# EAGLE design PI3523_EVAL_v2 (EAGLE 9.6.2)
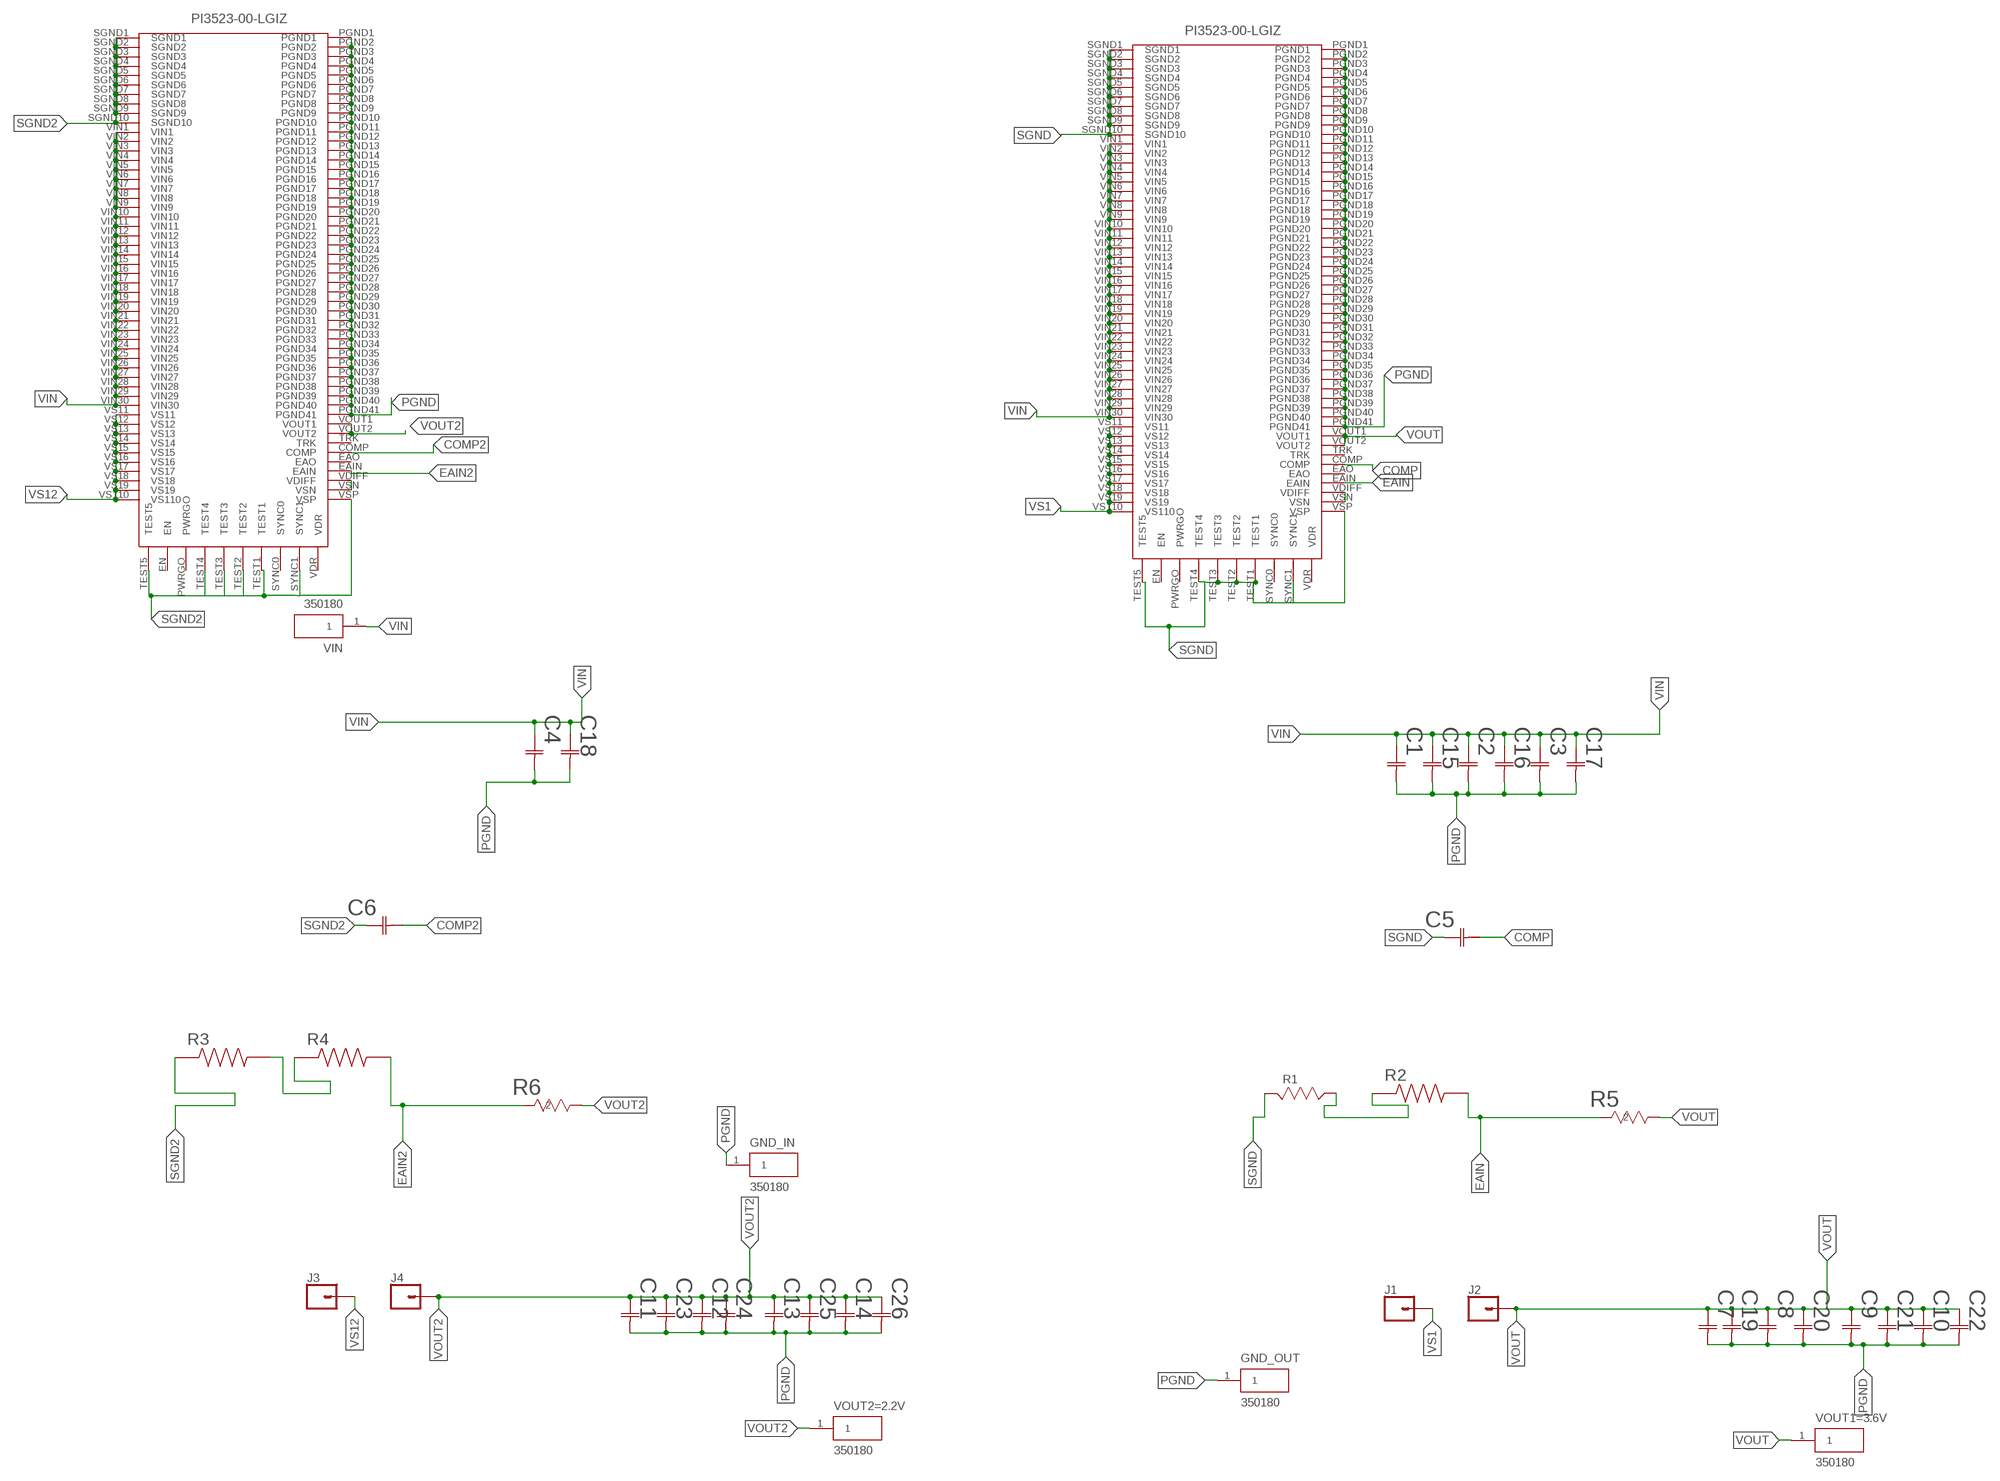
[diagram p0: schematic, sheet 1]

## Parts
C1  GRM32ER72A225KA35L  [G-32_MUR]
C2  GRM32ER72A225KA35L  [G-32_MUR]
C3  GRM32ER72A225KA35L  [G-32_MUR]
C4  GRM32ER72A225KA35L  [G-32_MUR]
C5  C1608C0G2A472J080AC  [CAP_C1608_TDK]
C6  C1608C0G2A472J080AC  [CAP_C1608_TDK]
C7  GRM32EC80J107ME20L  [G-32_MUR]
C8  GRM32EC80J107ME20L  [G-32_MUR]
C9  GRM32EC80J107ME20L  [G-32_MUR]
C10  GRM32EC80J107ME20L  [G-32_MUR]
C11  GRM32EC80J107ME20L  [G-32_MUR]
C12  GRM32EC80J107ME20L  [G-32_MUR]
C13  GRM32EC80J107ME20L  [G-32_MUR]
C14  GRM32EC80J107ME20L  [G-32_MUR]
C15  GRM32ER72A225KA35L  [G-32_MUR]
C16  GRM32ER72A225KA35L  [G-32_MUR]
C17  GRM32ER72A225KA35L  [G-32_MUR]
C18  GRM32ER72A225KA35L  [G-32_MUR]
C19  GRM32EC80J107ME20L  [G-32_MUR]
C20  GRM32EC80J107ME20L  [G-32_MUR]
C21  GRM32EC80J107ME20L  [G-32_MUR]
C22  GRM32EC80J107ME20L  [G-32_MUR]
C23  GRM32EC80J107ME20L  [G-32_MUR]
C24  GRM32EC80J107ME20L  [G-32_MUR]
C25  GRM32EC80J107ME20L  [G-32_MUR]
C26  GRM32EC80J107ME20L  [G-32_MUR]
GND_IN  350180  [TE_350180]
GND_OUT  350180  [TE_350180]
J1  CONN_01  [1X01]
J2  CONN_01  [1X01]
J3  CONN_01  [1X01]
J4  CONN_01  [1X01]
R1  ERJ-3GEY0R00V  [RESC1608X55]
R2  ERA-3APB911V  [RESC1608X55N]
R3  ERJ-3BQJ3R6V  [RESC1608X55N]
R4  ERA-3AEB1961V  [RESC1608X55N]
R5  RT0603BRE072K4L  [RC0603N_YAG]
R6  RT0603BRE072K4L  [RC0603N_YAG]
U$1  PI3523-00-LGIZ  [PI3523-00-LGIZ]
U$2  PI3523-00-LGIZ  [PI3523-00-LGIZ]
VIN  350180  [TE_350180]
VOUT1=3.6V  350180  [TE_350180]
VOUT2=2.2V  350180  [TE_350180]

## Nets
COMP: C5.2 U$2.COMP
COMP2: C6.2 U$1.COMP
EAIN: R2.2 R5.2 U$2.EAIN
EAIN2: R4.2 R6.2 U$1.EAIN
N$3: R3.2 R4.1
N$4: U$2.VDIFF U$2.VSN
N$5: U$1.VDIFF U$1.VSN
PGND [New Class]: C1.2 C2.2 C3.2 C4.2 C7.2 C8.2 C9.2 C10.2 C11.2 C12.2 C13.2 C14.2 C15.2 C16.2 C17.2 C18.2 C19.2 C20.2 C21.2 C22.2 C23.2 C24.2 C25.2 C26.2 GND_IN.1 GND_OUT.1 U$1.PGND1 U$1.PGND2 U$1.PGND3 U$1.PGND4 U$1.PGND5 U$1.PGND6 U$1.PGND7 U$1.PGND8 U$1.PGND9 U$1.PGND10 U$1.PGND11 U$1.PGND12 U$1.PGND13 U$1.PGND14 U$1.PGND15 U$1.PGND16 U$1.PGND17 U$1.PGND18 U$1.PGND19 U$1.PGND20 U$1.PGND21 U$1.PGND22 U$1.PGND23 U$1.PGND24 U$1.PGND25 U$1.PGND26 U$1.PGND27 U$1.PGND28 U$1.PGND29 U$1.PGND30 U$1.PGND31 U$1.PGND32 U$1.PGND33 U$1.PGND34 U$1.PGND35 U$1.PGND36 U$1.PGND37 U$1.PGND38 U$1.PGND39 U$1.PGND40 U$1.PGND41 U$2.PGND1 U$2.PGND2 U$2.PGND3 U$2.PGND4 U$2.PGND5 U$2.PGND6 U$2.PGND7 U$2.PGND8 U$2.PGND9 U$2.PGND10 U$2.PGND11 U$2.PGND12 U$2.PGND13 U$2.PGND14 U$2.PGND15 U$2.PGND16 U$2.PGND17 U$2.PGND18 U$2.PGND19 U$2.PGND20 U$2.PGND21 U$2.PGND22 U$2.PGND23 U$2.PGND24 U$2.PGND25 U$2.PGND26 U$2.PGND27 U$2.PGND28 U$2.PGND29 U$2.PGND30 U$2.PGND31 U$2.PGND32 U$2.PGND33 U$2.PGND34 U$2.PGND35 U$2.PGND36 U$2.PGND37 U$2.PGND38 U$2.PGND39 U$2.PGND40 U$2.PGND41
R21_1: R1.2 R2.1
SGND: C5.1 R1.1 U$2.SGND1 U$2.SGND2 U$2.SGND3 U$2.SGND4 U$2.SGND5 U$2.SGND6 U$2.SGND7 U$2.SGND8 U$2.SGND9 U$2.SGND10 U$2.SYNC1 U$2.TEST1 U$2.TEST2 U$2.TEST3 U$2.TEST4 U$2.TEST5 U$2.VSP
SGND2: C6.1 R3.1 U$1.SGND1 U$1.SGND2 U$1.SGND3 U$1.SGND4 U$1.SGND5 U$1.SGND6 U$1.SGND7 U$1.SGND8 U$1.SGND9 U$1.SGND10 U$1.SYNC1 U$1.TEST1 U$1.TEST2 U$1.TEST3 U$1.TEST4 U$1.TEST5 U$1.VSP
VIN: C1.1 C2.1 C3.1 C4.1 C15.1 C16.1 C17.1 C18.1 U$1.VIN1 U$1.VIN2 U$1.VIN3 U$1.VIN4 U$1.VIN5 U$1.VIN6 U$1.VIN7 U$1.VIN8 U$1.VIN9 U$1.VIN10 U$1.VIN11 U$1.VIN12 U$1.VIN13 U$1.VIN14 U$1.VIN15 U$1.VIN16 U$1.VIN17 U$1.VIN18 U$1.VIN19 U$1.VIN20 U$1.VIN21 U$1.VIN22 U$1.VIN23 U$1.VIN24 U$1.VIN25 U$1.VIN26 U$1.VIN27 U$1.VIN28 U$1.VIN29 U$1.VIN30 U$2.VIN1 U$2.VIN2 U$2.VIN3 U$2.VIN4 U$2.VIN5 U$2.VIN6 U$2.VIN7 U$2.VIN8 U$2.VIN9 U$2.VIN10 U$2.VIN11 U$2.VIN12 U$2.VIN13 U$2.VIN14 U$2.VIN15 U$2.VIN16 U$2.VIN17 U$2.VIN18 U$2.VIN19 U$2.VIN20 U$2.VIN21 U$2.VIN22 U$2.VIN23 U$2.VIN24 U$2.VIN25 U$2.VIN26 U$2.VIN27 U$2.VIN28 U$2.VIN29 U$2.VIN30 VIN.1
VOUT: C7.1 C8.1 C9.1 C10.1 C19.1 C20.1 C21.1 C22.1 J2.1 R5.1 U$2.VOUT1 U$2.VOUT2 VOUT1=3.6V.1
VOUT2: C11.1 C12.1 C13.1 C14.1 C23.1 C24.1 C25.1 C26.1 J4.1 R6.1 U$1.VOUT1 U$1.VOUT2 VOUT2=2.2V.1
VS1: J1.1 U$2.VS11 U$2.VS12 U$2.VS13 U$2.VS14 U$2.VS15 U$2.VS16 U$2.VS17 U$2.VS18 U$2.VS19 U$2.VS110
VS12: J3.1 U$1.VS11 U$1.VS12 U$1.VS13 U$1.VS14 U$1.VS15 U$1.VS16 U$1.VS17 U$1.VS18 U$1.VS19 U$1.VS110
Unconnected: U$1.EAO U$1.EN U$1.PWRGO U$1.SYNC0 U$1.TRK U$1.VDR U$2.EAO U$2.EN U$2.PWRGO U$2.SYNC0 U$2.TRK U$2.VDR

## Library data of the parts
C1-C4 C15-C18 = PI3523_1_1_ul_GRM32ER72A225KA35L:GRM32ER72A225KA35L; COPYRIGHT: Copyright (C) 2015 Accelerated Designs. All rights reserved; MANUFACTURER_PART_NUMBER: GRM32ER72A225KA35L; SOURCELIBRARY: Murata_2014-12-31; VENDOR: Murata
C5 C6 = PI3523_1_3_ul_C1608C0G2A472J080AC:C1608C0G2A472J080AC; BUILT_BY: EMA_Matt; COPYRIGHT: Copyright (C) 2018 Accelerated Designs. All rights reserved; MANUFACTURER_PART_NUMBER: C1608C0G2A472J080AC; SOURCELIBRARY: TDK_2019-10-09; VENDOR: TDK
C7-C14 C19-C26 = PI3523_C_back:GRM32EC80J107ME20L; COPYRIGHT: Copyright (C) 2015 Accelerated Designs. All rights reserved; MANUFACTURER_PART_NUMBER: GRM32EC80J107ME20L; SOURCELIBRARY: Murata_2014-12-31; VENDOR: Murata
GND_IN GND_OUT VIN VOUT1=3.6V VOUT2=2.2V = PI3523_banana_connector_350180:350180: Connector TeStraight Probe RCP 3 Position Solder Right Angle Thru-Hole 1 Port Check prices <https://pricing.snapeda.com/parts/350180/TE%20Connectivity/view-part?ref=eda>; AVAILABILITY: Good; COMMENT: 350180; DESCRIPTION: Connector TeStraight Probe RCP 3 Position Solder Right Angle Thru-Hole 1 Port; MF: TE Connectivity; MP: 350180; PACKAGE: None; PRICE: None; PURCHASE-URL: https://pricing.snapeda.com/search/part/350180/?ref=eda
J1-J4 = SparkFun-Connectors:CONN_01: Single connection point. Often used as Generic Header-pin footprint for 0.1 inch spaced/style header connections On any of the 0.1 inch spaced packages, you can populate with these: Break Away Headers - Straight <https://www.sparkfun.com/products/116> (PRT-00116) Break Away Male Headers - Right Angle <https://www.sparkfun.com/products/553> (PRT-00553) Female Headers <https://www.sparkfun.com/products/115> (PRT-00115) Break Away Headers - Machine Pin <https://www.sparkfun.com/products/117> (PRT-00117) Break Away Female Headers - Swiss Machine Pin <https://www.sparkfun.com/products/743> (PRT-00743) This device is also useful as a general connection point to wire up your design to another part of your project. Our various solder wires solder well into these plated through hole pads. Hook-Up Wire - Assortment (Stranded, 22 AWG) <https://www.sparkfun.com/products/11375> (PRT-11375) Hook-Up Wire - Assortment (Solid Core, 22 AWG) <https://www.sparkfun.com/products/11367> (PRT-11367) View the entire wire category on our website here <https://www.sparkfun.com/categories/141> Special notes: SMTSO-256-ET is a "flush mount" nut for a 4-40 screw. We mostly use this on specialty testbeds; it is a nice way to connect hardware to your PCB at an adjustable hieght. Also note, the SNAP packages are for using a snappable style connector. We sell a baggie of snaps and they are also used on two LilyPad designs: Snap Assortment - 30 pack (male and female) <https://www.sparkfun.com/products/11347> (DEV-11347) LilyPad Arduino SimpleSnap <https://www.sparkfun.com/products/10941> (DEV-10941) LilyPad SimpleSnap Protoboard <https://www.sparkfun.com/products/10940> (DEV-10940)
R1 = PI3523_R3.6_2:ERJ-3GEY0R00V: Resistor, Chip Thick Film, 0 Ohm, 0.1w, Resistor, Chip Thick Film, 0 Ohm, 0.1w, 5% Check prices <https://pricing.snapeda.com/parts/ERJ-3GEY0R00V/Panasonic%20Electronic/view-part?ref=eda>; AVAILABILITY: Good; DESCRIPTION: 0 Ohms Jumper 0.1W, 1/10W Chip Resistor 0603 (1608 Metric) Automotive AEC-Q200 Thick Film; MF: Panasonic Electronic; MP: ERJ-3GEY0R00V; PACKAGE: 1608 Panasonic Electronic Components; PRICE: None; PURCHASE-URL: https://pricing.snapeda.com/search/part/ERJ-3GEY0R00V/?ref=eda
R2 = PI3523_R3.6_1:ERA-3APB911V: Check prices <https://pricing.snapeda.com/parts/ERA-3APB911V/Panasonic/view-part?ref=eda>; AVAILABILITY: Warning; DESCRIPTION: 910 Ohms ±0.1% 0.1W, 1/10W Chip Resistor 0603 (1608 Metric) Automotive AEC-Q200 Thin Film; MF: Panasonic; MP: ERA-3APB911V; PACKAGE: 1608 Panasonic Electronic Components; PRICE: None; PURCHASE-URL: https://pricing.snapeda.com/search/part/ERA-3APB911V/?ref=eda
R3 = PI3523_R2.2_2:ERJ-3BQJ3R6V: RES SMD 3.6 OHM 5% 1/4W 0603; AVAILABILITY: Unavailable; DESCRIPTION: Res Thick Film 0603 3.6 Ohm 5% 0.25W(1/4W) ±200ppm/°C Pad SMD Automotive T/R; MF: Panasonic; MP: ERJ-3BQJ3R6V; PACKAGE: 1608 Panasonic Electronic Components; PRICE: None
R4 = PI3523_R2.2_1:ERA-3AEB1961V: Check prices <https://pricing.snapeda.com/parts/ERA-3AEB1961V/Panasonic/view-part?ref=eda>; AVAILABILITY: Good; DESCRIPTION: 1.96 kOhms ±0.1% 0.1W, 1/10W Chip Resistor 0603 (1608 Metric) Automotive AEC-Q200 Thin Film; MF: Panasonic; MP: ERA-3AEB1961V; PACKAGE: 1608 Panasonic Electronic Components; PRICE: None; PURCHASE-URL: https://pricing.snapeda.com/search/part/ERA-3AEB1961V/?ref=eda
R5 R6 = PI3523_R210:RT0603BRE072K4L; BUILT_BY: EMA_UL_Team; MANUFACTURER_PART_NUMBER: RT0603BRE072K4L; SOURCELIBRARY: Yageo_2008-01-01_ChipRes3a; VENDOR: Yageo
U$1 U$2 = PI3523-00-LGIZ_TGLee:PI3523-00-LGIZ

## Board
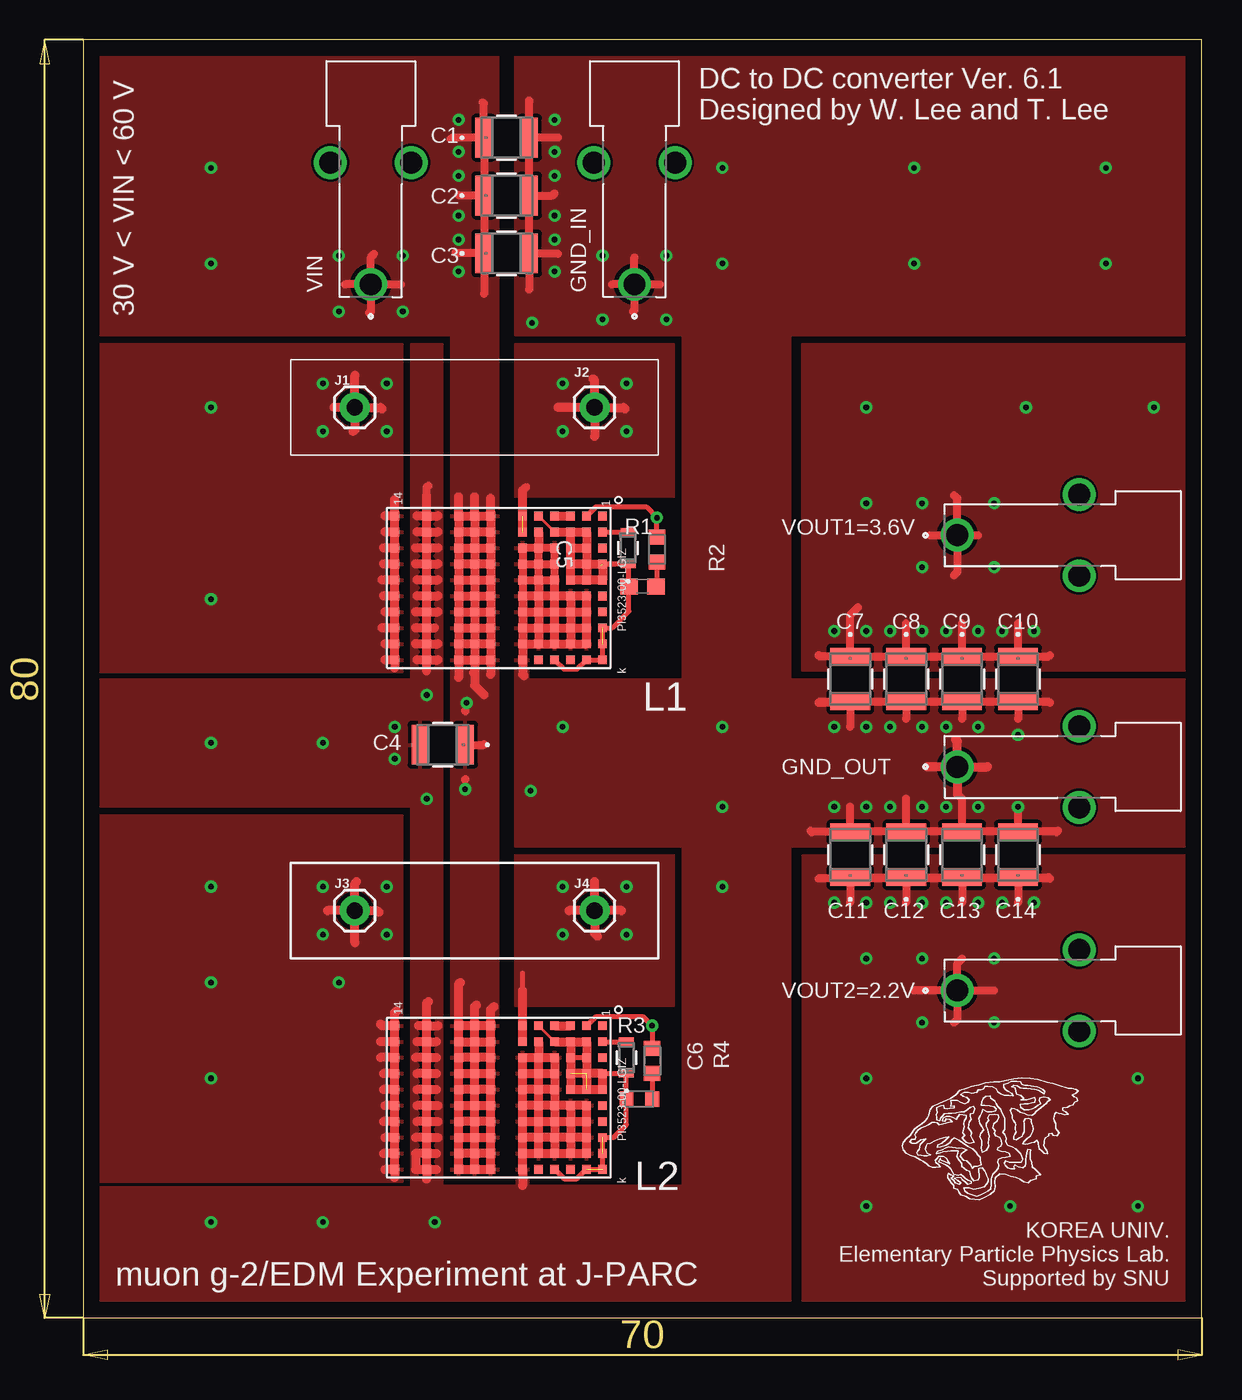
[diagram p1: board, top side]
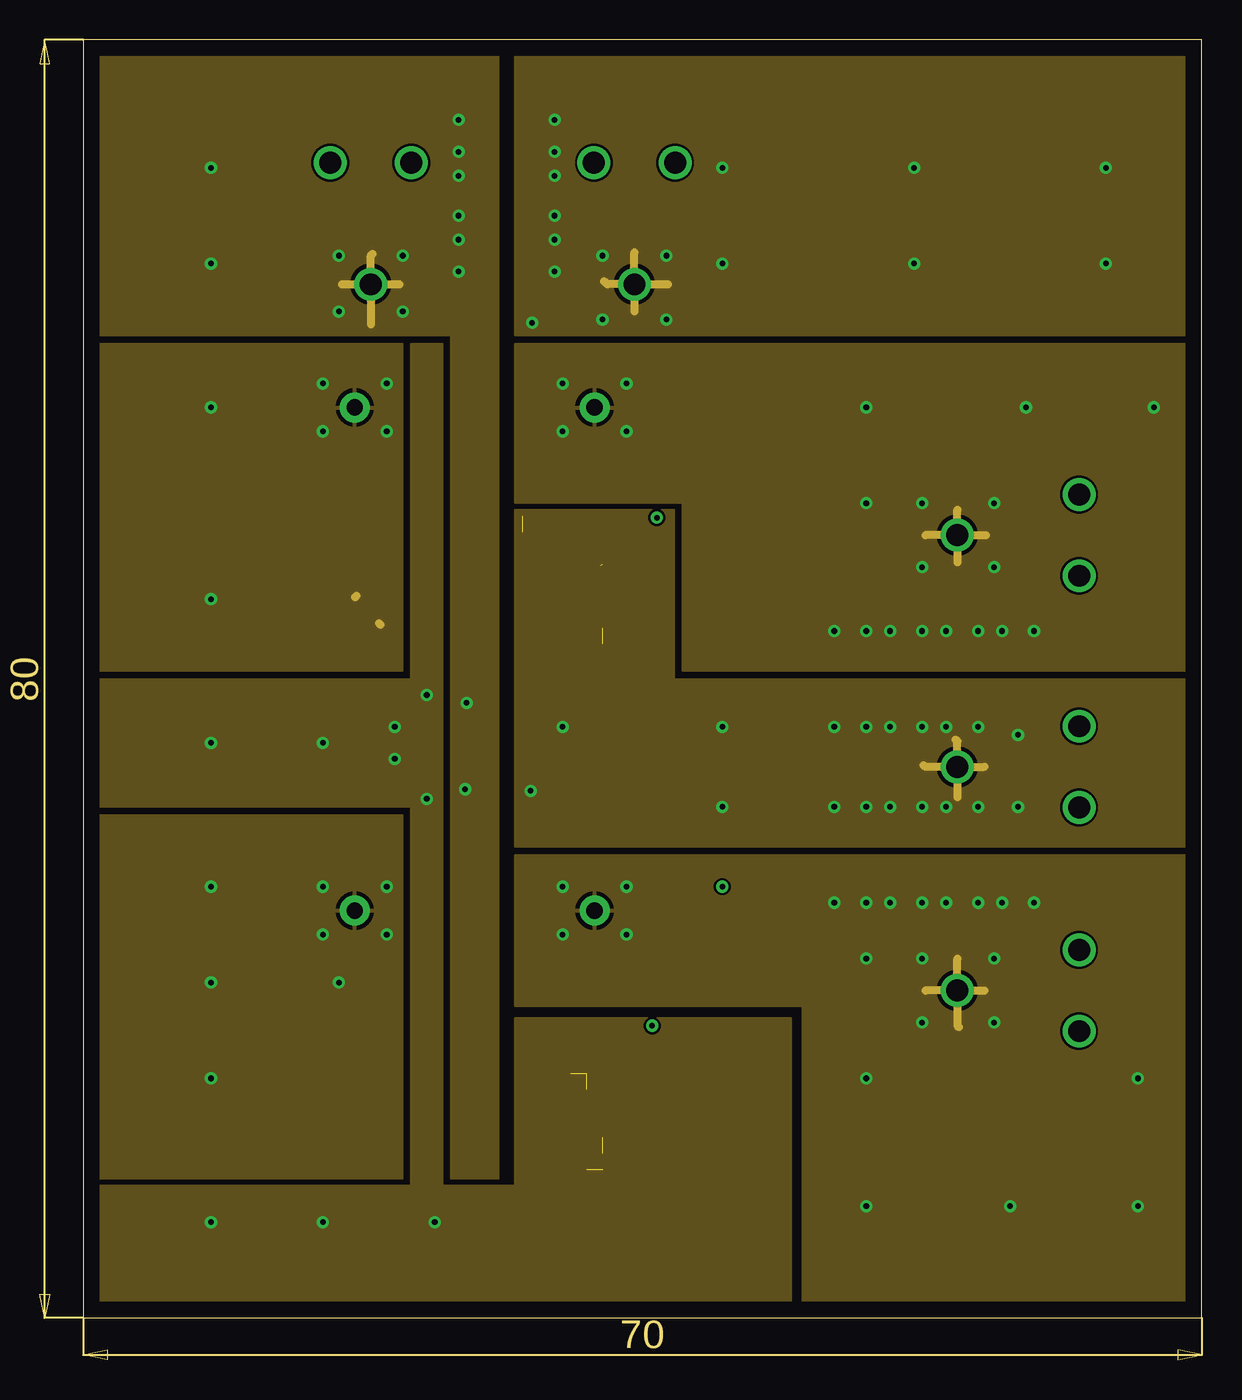
[diagram p2: board, inner layer Route2]
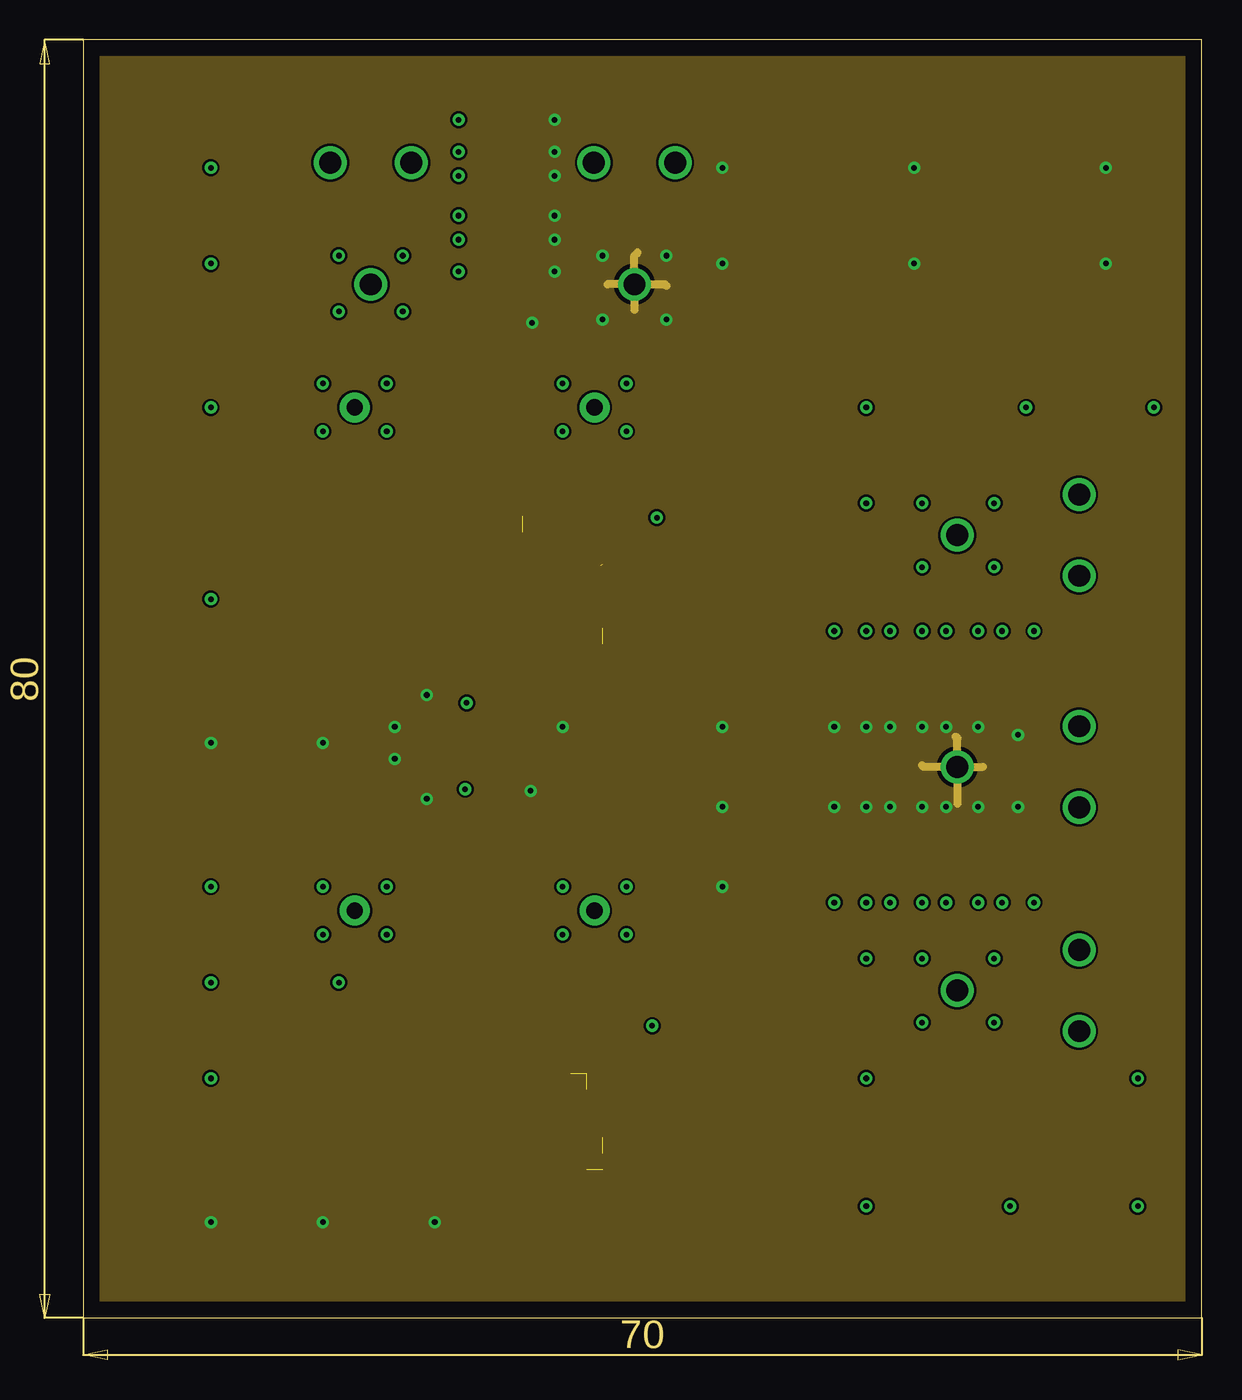
[diagram p3: board, inner layer Route15]
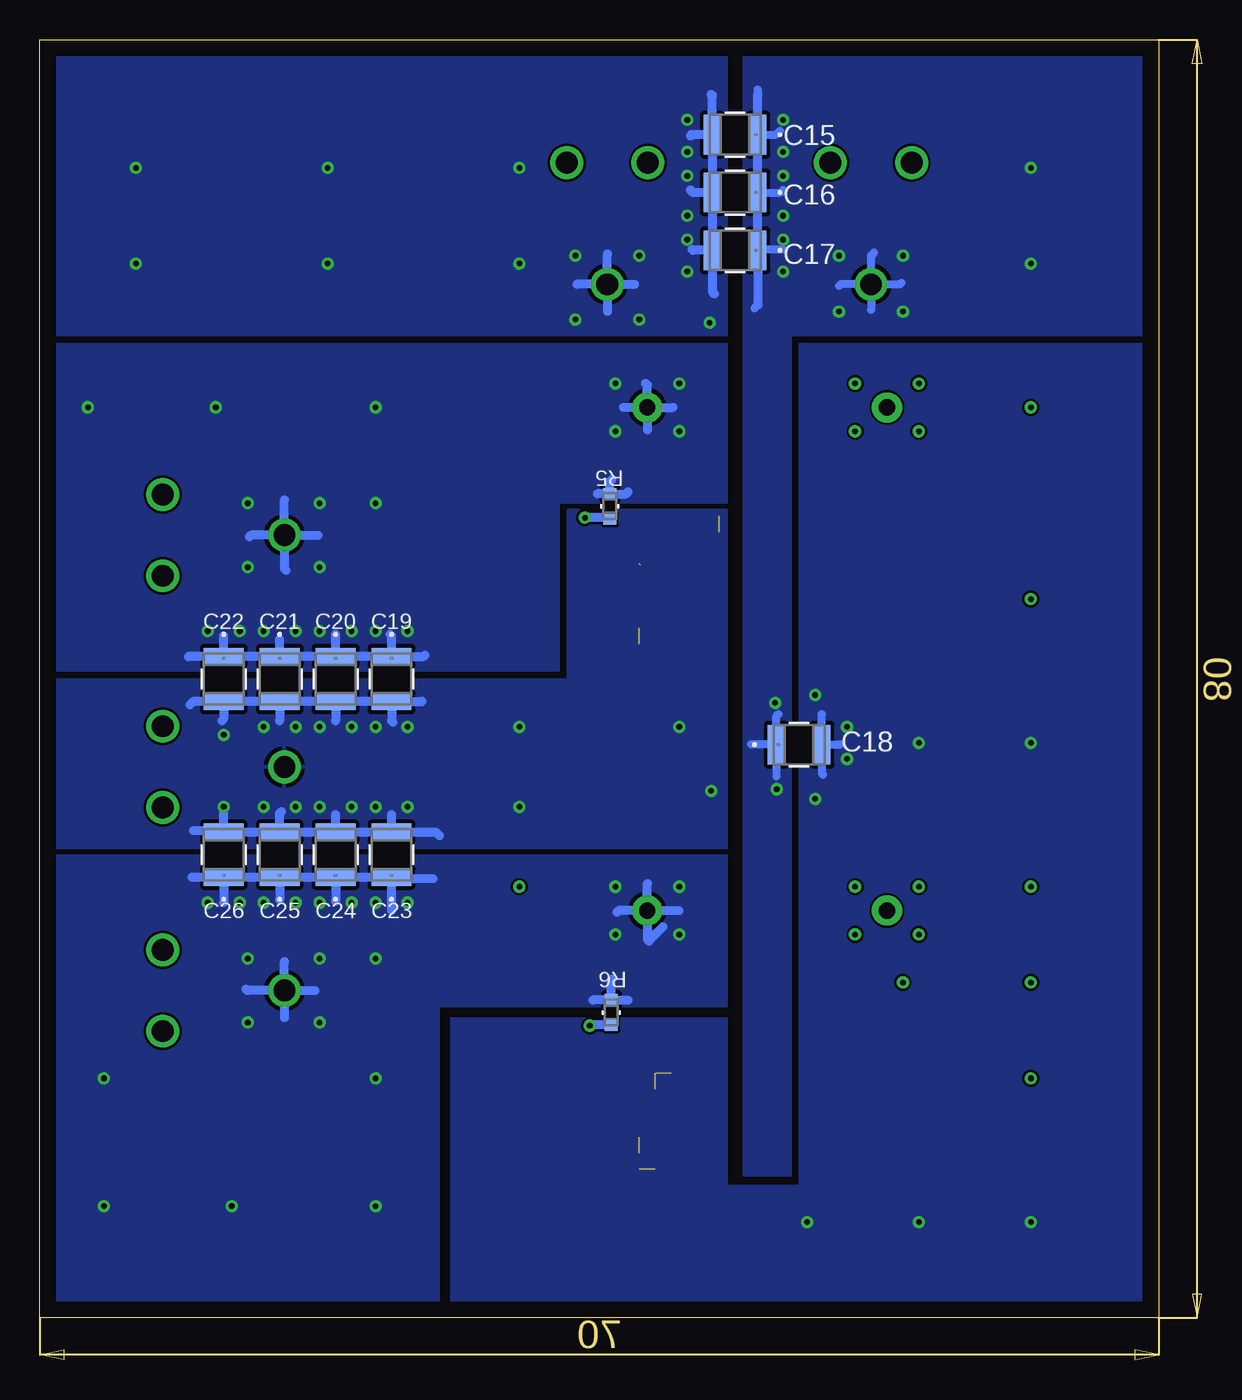
[diagram p4: board, bottom side, seen from below]

Size 70 x 80 mm. Coordinates in mm from the lower left corner, seen from the top.
Outline: 0,80 0,0 70,0 70,80 0,80
Copper layers (1+2*15+16): Top 0.035mm / dielectric 1.5mm / Route2 0.035mm / dielectric 0.15mm / Route15 0.035mm / dielectric 0.2mm / Bottom 0.035mm
Design rules "default *": minimum track width 6mil, minimum drill 0.35mm, track to track 6mil, track to pad 6mil, pad to pad 6mil, via to via 6mil, smd to smd 6mil, copper to edge 40mil, drill to drill 6mil, minimum pad ring 10mil, minimum via ring 8mil, stop-mask expansion 4mil, vias tented up to drill 0mil, thermal gap 10mil

### Footprints (pad centres in the part's own frame; a part is rotated, then mirrored left to right if it is on the bottom)
G-32_MUR = smd 1.061 x 2.489: 1 -1.42,0; 2 1.42,0
CAP_C1608_TDK = smd 0.553 x 0.94: 1 -0.975,0; 2 0.975,0
TE_350180 = drill 1.372: 1 0,0; S1 7.62,2.54; S2 7.62,-2.54
1X01 = drill 1.016 pad 1.88: 1 0,0
RESC1608X55 = smd 1.1 x 1: 1 -0.85,0; 2 0.85,0
RESC1608X55N = smd 0.94 x 1.02: 1 -0.79,0; 2 0.79,0
RESC1608X55N' = smd 0.87 x 0.98: 1 -0.8,0; 2 0.8,0
RC0603N_YAG = smd 0.756 x 0.813: 1 -0.772,0; 2 0.772,0
PI3523-00-LGIZ = smd 0.55 x 0.55: COMP 1,0; EAIN 0,-1; EAO 0,0; EN 5,0; PGND1 5,-1; PGND2 6,-1; PGND3 7,-1; PGND4 8,-1; PGND5 5,-2; PGND6 6,-2; PGND7 7,-2; PGND8 8,-2; PGND9 2,-3; PGND10 3,-3; PGND11 4,-3; PGND12 5,-3; PGND13 6,-3; PGND14 7,-3; PGND15 8,-3; PGND16 1,-4; PGND17 2,-4; PGND18 3,-4; PGND19 4,-4; PGND20 5,-4; PGND21 6,-4; PGND22 7,-4; PGND23 8,-4; PGND24 2,-5; PGND25 3,-5; PGND26 4,-5; PGND27 5,-5; PGND28 6,-5; PGND29 7,-5; PGND30 8,-5; PGND31 9,-5; PGND32 0,-11; PGND33 1,-11; PGND34 2,-11; PGND35 3,-11; PGND36 4,-11; PGND37 5,-11; PGND38 6,-11; PGND39 7,-11; PGND40 8,-11; PGND41 9,-11; PWRGO 6,0; SGND1 3,0; SGND2 1,-1; SGND3 2,-1; SGND4 3,-1; SGND5 4,-1; SGND6 1,-2; SGND7 2,-2; SGND8 3,-2; SGND9 4,-2; SGND10 1,-3; SYNC0 9,-2; SYNC1 9,-3; TEST1 9,-1; TEST2 9,0; TEST3 8,0; TEST4 7,0; TEST5 4,0; TRK 2,0; VDIFF 0,-2; VDR 9,-4; VIN1 0,-7; VIN2 1,-7; VIN3 2,-7; VIN4 3,-7; VIN5 4,-7; VIN6 5,-7; VIN7 6,-7; VIN8 7,-7; VIN9 8,-7; VIN10 9,-7; VIN11 0,-8; VIN12 1,-8; VIN13 2,-8; VIN14 3,-8; VIN15 4,-8; VIN16 5,-8; VIN17 6,-8; VIN18 7,-8; VIN19 8,-8; VIN20 9,-8; VIN21 0,-9; VIN22 1,-9; VIN23 2,-9; VIN24 3,-9; VIN25 4,-9; VIN26 5,-9; VIN27 6,-9; VIN28 7,-9; VIN29 8,-9; VIN30 9,-9; VOUT1 0,-5; VOUT2 1,-5; VS11 0,-13; VS12 1,-13; VS13 2,-13; VS14 3,-13; VS15 4,-13; VS16 5,-13; VS17 6,-13; VS18 7,-13; VS19 8,-13; VS110 9,-13; VSN 0,-3; VSP 0,-4

### Placement (x,y rotation side)
C1  26.5,73.88 0 top
C2  26.5,70.26 0 top
C3  26.5,66.64 0 top
C4  22.5,35.88 180 top
C5  34.1,48.2 90 top
C6  34,16.3 90 top
C7  48,40 270 top
C8  51.5,40 270 top
C9  55,40 270 top
C10  58.5,40 270 top
C11  48,29 90 top
C12  51.5,29 90 top
C13  55,29 90 top
C14  58.5,29 90 top
C15  26.5,74.07 180 bottom
C16  26.5,70.45 180 bottom
C17  26.5,66.83 180 bottom
C18  22.5,35.88 0 bottom
C19  48,40 270 bottom
C20  51.5,40 270 bottom
C21  55,40 270 bottom
C22  58.5,40 270 bottom
C23  48,29 90 bottom
C24  51.5,29 90 bottom
C25  55,29 90 bottom
C26  58.5,29 90 bottom
GND_IN  34.5,64.7 90 top
GND_OUT  54.7,34.5 0 top
J1  17,57 0 top
J2  32,57 0 top
J3  17,25.5 0 top
J4  32,25.5 0 top
R1  35,45.8 0 top
R2  35.9,48.1 90 top
R3  ERJ-3BQJ3R6V  [RESC1608X55N']  34.8,13.7 0 top
R4  35.6,16.1 90 top
R5  34.34,50.81 270 bottom
R6  34.24,19.12 270 bottom
U$1  32.5,18.3 270 top
U$2  32.5,50.2 270 top
VIN  18,64.7 90 top
VOUT1=3.6V  54.7,49 0 top
VOUT2=2.2V  54.7,20.5 0 top

### Tracks (layer width: path | path; a pad name or v marks a point on that pad's centre or on a via)
COMP
  Top 0.3: U$2.COMP 33.9,49.2 33.92,49.17 C5.2
COMP2
  Top 0.3: U$1.COMP 33.98,17.3 C6.2
EAIN  (via drill 0.35)
  Top 0.3: R2.2 v35.9,50.1 35.22,50.78 32.1,50.78 31.52,50.2 U$2.EAIN
  Bottom 0.55: R5.2 34.4,50.1 v35.9,50.1
EAIN2  (via drill 0.35)
  Top 0.3: R4.2 v35.6,18.3 35.02,18.88 32.1,18.88 31.52,18.3 U$1.EAIN
  Bottom 0.55: R6.2 35.55,18.35 v35.6,18.3
N$3
  Top 0.3: R4.1 R3.2
N$4
  Top 0.55: U$2.VSN U$2.VDIFF
N$5
  Top 0.55: U$1.VSN U$1.VDIFF
PGND  (via drill 0.35, 0.35 pad 0.55)
  Top 0.5: C19.2 47.92,38.5 46,38.5 46.08,38.58 C19.2 | C19.2 60.42,38.58 60.5,38.5 | C20.2 51.5,37.5 | C21.2 55,37.5 | C10.2 58.5,37.5 | C19.2 48,37 | 54.7,32.8 55,32.5 C25.2 | C23.2 48.08,30.5 61,30.5 60.92,30.42 | C23.2 45.58,30.42 45.5,30.5 | C23.2 48,32 | C24.2 51.5,32.5 | C26.2 v58.5,32 | C3.2 29.66,66.64 29.7,66.6 | C3.2 27.92,64.42 27.9,64.4 | C3.2 27.92,76.18 27.9,76.2 | C1.2 27.94,73.9 29.7,73.9 | C2.2 29.36,70.26 29.5,70.4 | GND_IN.1 36.1,64.7 | GND_IN.1 33.1,64.7 | GND_IN.1 34.5,63.1 34.4,63 | GND_IN.1 34.5,66.4 | U$2.PGND26 U$2.PGND27 | U$2.PGND26 U$2.PGND11 29.5,47.1 | 29.5,47.1 U$2.PGND9 U$2.PGND17 | U$2.PGND17 U$2.PGND24 U$2.PGND26 | U$2.PGND19 U$2.PGND17 | U$2.PGND25 29.4,47.2 29.5,47.1 | U$2.PGND32 21.5,51.5 21.5,52 21.6,52.1
  Top 0.55: U$1.PGND16 U$1.PGND17 | U$2.PGND16 U$2.PGND17 | 27.6,40.2 27.5,40.3 U$2.PGND31 U$2.PGND27 U$2.PGND1 U$2.PGND2 | U$2.PGND30 U$2.PGND23 | U$2.PGND23 30.7,42.2 | 30.7,42.2 U$2.PGND4 31.5,43 | 31.5,43 U$2.PGND2 | U$2.PGND19 U$2.PGND23 | U$2.PGND28 U$2.PGND2 | U$2.PGND29 31.3,43.2 31.5,43 | U$2.PGND15 U$2.PGND11 | U$2.PGND5 30.5,42.4 30.7,42.2 | 21.5,40.5 U$2.PGND41 | U$2.PGND41 U$2.PGND34 | U$2.PGND34 21.5,51.5 | 20.9,50.2 U$2.PGND32 22.2,50.2 | 20.9,49.2 U$2.PGND33 22.2,49.2 | 22.2,48.2 U$2.PGND34 | U$2.PGND34 20.8,48.2 | 20.8,47.2 U$2.PGND35 22.2,47.2 | 22.2,46.2 U$2.PGND36 20.9,46.2 | 22.2,45.2 U$2.PGND37 20.9,45.2 | 22.2,44.2 U$2.PGND38 20.8,44.2 | 22,43.2 U$2.PGND39 20.8,43.2 | 22.2,42.2 U$2.PGND40 20.8,42.2 | U$2.PGND41 22.2,41.2 | U$2.PGND41 20.9,41.2 | U$1.PGND41 22.1,9.3 | U$1.PGND41 20.8,9.3 20.8,10.3 U$1.PGND40 22.1,10.3 | U$1.PGND41 21.5,8.7 | U$1.PGND41 21.5,19.7 21.6,19.8 | 21,18.3 U$1.PGND32 22.2,18.3 | 22.1,17.3 U$1.PGND33 20.9,17.3 | 22.1,16.3 U$1.PGND34 20.8,16.3 | 22.1,15.3 U$1.PGND35 20.9,15.3 | 22.1,14.3 U$1.PGND36 20.9,14.3 | 22.2,13.3 U$1.PGND37 20.9,13.3 | 22.2,12.3 U$1.PGND38 20.9,12.3 | 22.2,11.3 U$1.PGND39 20.8,11.3 | 27.5,8.3 U$1.PGND31 U$1.PGND29 | U$1.PGND29 U$1.PGND27 | U$1.PGND27 U$1.PGND26 | U$1.PGND26 U$1.PGND24 U$1.PGND17 | U$1.PGND17 U$1.PGND9 U$1.PGND10 | U$1.PGND30 U$1.PGND15 | U$1.PGND15 U$1.PGND8 | U$1.PGND8 U$1.PGND4 U$1.PGND2 | U$1.PGND2 U$1.PGND1 U$1.PGND27 | U$1.PGND28 U$1.PGND2 | U$1.PGND3 U$1.PGND29 | U$1.PGND23 U$1.PGND17 | U$1.PGND10 U$1.PGND15 | U$1.PGND11 U$1.PGND26 | U$1.PGND25 U$1.PGND10 | U$1.PGND5 U$1.PGND8 | GND_OUT.1 52.8,34.5 | GND_OUT.1 56.6,34.5 | GND_OUT.1 54.7,32.8 | GND_OUT.1 54.7,36.1 54.6,36.2
  Route2 0.5: GND_IN.1 36.6,64.7 | GND_IN.1 32.8,64.7 32.6,64.9 | GND_IN.1 34.5,63 | GND_IN.1 34.5,66.7 | GND_OUT.1 56.4,34.5 | GND_OUT.1 52.7,34.5 52.6,34.6 | GND_OUT.1 54.7,32.6 | GND_OUT.1 54.7,36.1 54.6,36.2
  Route15 0.5: GND_IN.1 36.4,64.7 36.5,64.6 | GND_IN.1 32.8,64.7 | GND_IN.1 34.5,63.1 | GND_IN.1 34.5,66.5 34.7,66.7 | GND_OUT.1 56.3,34.5 | GND_OUT.1 52.6,34.5 52.5,34.6 | GND_OUT.1 54.7,32.2 | GND_OUT.1 54.7,36.3 54.6,36.4
  Bottom 0.5: C4.2 21.06,35.9 19.9,35.9 | C4.2 21.08,34.08 21,34 | C4.2 21.08,37.78 21.1,37.8
  Bottom 0.55: C19.2 46.12,38.58 46.1,38.6 | C19.2 60.42,38.58 60.6,38.4 | C10.2 58.5,37.5 58.6,37.4 | C21.2 55,37.4 | C20.2 51.5,37.4 | C19.2 48,37.4 47.9,37.3 | GND_IN.1 36.4,64.7 | GND_IN.1 34.5,66.6 | GND_IN.1 34.5,63 | GND_IN.1 32.8,64.7 | C26.2 45.22,30.42 45,30.2 | C26.2 58.58,30.5 60.4,30.5 | C26.2 v58.5,32 | C25.2 55,31.6 54.9,31.7 | C24.2 51.5,31.5 | C23.2 48,31.5 | C15.2 27.92,76.52 28,76.6 | C15.2 27.92,64.22 27.8,64.1 | C17.2 29.13,66.83 29.2,66.9 | C16.2 29.15,70.45 29.3,70.6 | C15.2 29.23,74.07 29.3,74
  other vias: 29.5,75 29.5,73 29.5,71.5 29.5,69 29.5,67.5 29.5,65.5 28.1,62.3 32.5,66.5 32.5,62.5 36.5,66.5 36.5,62.5 40,66 40,72 52,72 52,66 64,66 64,72 30,37 28,33 40,37 40,32 40,27 22,6 15,6 8,6 47,37 49,37 50.5,37 52.5,37 54,37 56,37 47,32 49,32 50.5,32 52.5,32 54,32 56,32 21.5,32.5 19.5,35 19.5,37 21.5,39 15,36 8,36 58.5,36.5
  pour Route15: 0,80 0,0 70,0 70,80
  pour Top: 22.5,61 20.5,61 20.5,40 0,40 0,32 20.5,32 20.5,8.2 0,8.2 0,0 44.29,0 44.29,29.5 70,29.5 70,40 44.29,40 44.29,61.5 70,61.5 70,80 27,80 27,61.5 37.5,61.5 37.5,40 27,40 27,29.5 37.5,29.5 37.5,8.3 22.5,8.3
  pour Bottom: 0,61 22.5,61 22.5,0 0,0
  pour Route2: 70,29.5 27,29.5 27,40 70,40
  pour Route2: 70,61.5 27,61.5 27,80 70,80
  pour Route2: 22.5,61 20.5,61 20.5,40 0,40 0,32 20.5,32 20.5,8.3 0,8.3 0,0 22.5,0
  pour Top: 27.9,39.8 27.9,41.8 31.8,41.8 31.8,45.6 29.8,45.6 29.8,48.6 27,48.6 27,39.8
  pour Top: 27.9,7.7 27.9,9.9 31.9,9.9 31.9,13.7 29.9,13.7 29.9,16.7 27.1,16.7 27.1,7.7
  pour Route2: 18.7,8.3 18.7,0 44.3,0 44.3,18.8 27,18.8 27,8.3
  pour Route2: 27,34.7 37,34.7 37,50.6 27,50.6
  pour Bottom: 27,80 27,61.5 70,61.5 70,80
  pour Bottom: 19.9,8.4 19.9,0 44.3,0 44.3,18.8 27,18.8 27,8.3 20,8.3
  pour Bottom: 27,50.6 27,29.4 70,29.4 70,40 37,40 37,50.6
R21_1
  Top 0.3: R2.1 35.9,45.85 R1.2
SGND  (2 unrouted)
  Top 0.2: U$2.VSP U$2.SGND10
  Top 0.3: 34,47.13 C5.1 | U$2.SYNC1 29.52,41.2 30.1,40.62 30.9,40.62 31.48,41.2 U$2.TEST1 U$2.TEST2 U$2.TEST4 33.1,43.2 34.15,44.25 R1.1 34.1,45.85 C5.1 | 32.4,47.13 32.5,47.23 C5.1 | U$2.SGND1 33.31,47.2
  Top 0.55: U$2.SGND5 31,46.2 U$2.SGND9 U$2.SGND8 | U$2.SGND8 30.5,47.7 30.5,48.7 U$2.SGND6 | 30.5,48.3 U$2.SGND7 U$2.SGND3 | U$2.SGND5 U$2.TEST5 U$2.SGND1 U$2.SGND4 U$2.SGND8 | U$2.SGND10 U$2.SGND2 U$2.SGND3 | U$2.SGND3 U$2.SGND5
SGND2  (4 unrouted)
  Top 0.2: U$1.VSP U$1.SGND10
  Top 0.3: U$1.SYNC1 29.52,9.3 30.1,8.72 30.9,8.72 31.48,9.3 U$1.TEST2 U$1.TEST4 33.2,11.3 34,12.1 R3.1 C6.1 33.98,15.3 U$1.SGND1 | U$1.SGND7 U$1.SGND3
  Top 0.55: U$1.SGND10 U$1.SGND2 U$1.SGND3 U$1.SGND5 | U$1.SGND8 U$1.SGND1 U$1.TEST5 U$1.SGND9 U$1.SGND6
VIN  (via drill 0.35)
  Top 0.5: 23.92,33.72 23.9,33.7 | C4.1 25.08,35.88 25.1,35.9 | 23.92,37.98 23.9,38 | VIN.1 19.9,64.7 | VIN.1 16.4,64.7 | VIN.1 18,63 17.9,62.9 | VIN.1 18,66.4 18.2,66.6 | C1.1 25.08,76.02 25,76.1 | C1.1 25.1,73.86 25.1,64.1 | C3.1 23.36,66.64 23.3,66.7 | C2.1 23.54,70.26 23.5,70.3 | C1.1 23.08,73.88 23,73.8 | 23.5,40.1 U$2.VIN30 | U$2.VIN20 24.5,40.5 24.4,40.4
  Top 0.55: U$2.VIN21 23.5,51.4 | 24.5,51.4 U$2.VIN11 24.5,39.6 25.1,39 | U$2.VIN1 25.5,51.3 | U$2.VIN21 U$2.VIN22 | U$2.VIN22 23.5,47.3 | 23.5,47.3 23.5,42.1 | 23.5,42.1 23.5,40.1 | U$2.VIN1 25.5,48.1 | 25.5,48.1 U$2.VIN5 | U$2.VIN5 U$2.VIN6 | U$2.VIN6 U$2.VIN7 | U$2.VIN7 U$2.VIN8 | U$2.VIN8 U$2.VIN10 | U$2.VIN10 25.5,40.3 | U$2.VIN30 U$2.VIN10 | U$2.VIN9 23.6,42.2 23.5,42.1 | U$2.VIN28 U$2.VIN8 | U$2.VIN27 U$2.VIN7 | U$2.VIN26 U$2.VIN6 | U$2.VIN25 U$2.VIN5 | U$2.VIN4 23.6,47.2 23.5,47.3 | U$2.VIN23 25.4,48.2 25.5,48.1 | U$2.VIN2 U$2.VIN22 | U$2.VIN21 U$2.VIN1 | U$1.VIN8 U$1.VIN10 U$1.VIN30 U$1.VIN29 | U$1.VIN8 U$1.VIN6 | U$1.VIN6 U$1.VIN4 | U$1.VIN4 U$1.VIN2 | U$1.VIN2 25.5,19.3 25.7,19.5 | U$1.VIN29 U$1.VIN27 | U$1.VIN27 U$1.VIN25 | U$1.VIN25 U$1.VIN23 | U$1.VIN23 U$1.VIN21 | U$1.VIN21 23.5,20.9 23.6,21 | U$1.VIN20 U$1.VIN11 | U$1.VIN11 24.5,19.5 24.6,19.6 | U$1.VIN11 U$1.VIN21 | U$1.VIN1 U$1.VIN11 | U$1.VIN22 U$1.VIN2 | U$1.VIN3 U$1.VIN23 | U$1.VIN24 U$1.VIN4 | U$1.VIN5 U$1.VIN25 | U$1.VIN26 U$1.VIN6 | U$1.VIN7 U$1.VIN27 | U$1.VIN28 U$1.VIN8 | U$1.VIN9 U$1.VIN29
  Route2 0.5: VIN.1 19.8,64.7 | 16.2,64.7 VIN.1 | VIN.1 18,62.2 | VIN.1 18,66.5 18.1,66.6
  Bottom 0.5: 25.1,76.9 25.08,76.88 25.08,76.6 C15.1 23.93,74.07 23.7,74.3 | 25.08,63.42 25.3,63.2 | C17.1 25.01,66.9 23.5,66.9 | C16.1 23.65,70.45 23.5,70.6 | C4.1 23.94,35.9 25.5,35.9 | C4.1 23.92,33.92 23.9,33.9 | C4.1 23.92,37.68 23.8,37.8 | VIN.1 19.9,64.7 20,64.6 | VIN.1 16.2,64.7 16.1,64.8 | VIN.1 18,63.1 | VIN.1 18,66.5 17.8,66.7
  Bottom 0.55: 25.08,63.42 C17.1 25.08,76.6
  other vias: 8,66 8,72 20,66.5 16,66.5 20,63 23.5,65.5 23.5,67.5 23.5,69 23.5,71.5 23.5,73 23.5,75 24,38.5 23.9,33.1 16,63
  pour Top: 23,8.9 26,8.9 26,80 23,80
  pour Top: 23,61.5 0,61.5 0,80 23,80
  pour Bottom: 26,80 0,80 0,61.5 23,61.5 23,8.9 26,8.9
  pour Route2: 26,80 0,80 0,61.5 23,61.5 23,8.7 26,8.7
VOUT  (via drill 0.35)  (1 unrouted)
  Top 0.3: U$2.VOUT1 27.4,50.3 | 27.7,52 27.8,52.1
  Top 0.5: 53,49 VOUT1=3.6V.1 | VOUT1=3.6V.1 56,49 | C19.1 46.08,41.42 46,41.5 | C19.1 60.42,41.42 60.5,41.5 | C20.1 51.5,43.5 | C19.1 48,44 48.5,44.5 | C21.1 55,43.5 | C10.1 58.5,43.5 | VOUT1=3.6V.1 54.7,46.7 54.5,46.5 | VOUT1=3.6V.1 54.7,51.3 54.5,51.5 | 27.5,51.8 27.7,52
  Top 0.55: U$2.VOUT2 27.5,51.8 | J2.1 29.7,57 | J2.1 33.8,57 33.9,56.9 | J2.1 32,58.7 31.9,58.8 | J2.1 32,55.2
  Route2 0.5: VOUT1=3.6V.1 56.5,49 | VOUT1=3.6V.1 52.7,49 | VOUT1=3.6V.1 54.7,47.3 | VOUT1=3.6V.1 54.7,50.6
  Bottom 0.55: C19.1 45.98,41.42 45.9,41.5 | C19.1 60.68,41.42 60.7,41.4 | C10.1 58.5,42.7 | C21.1 55,42.5 | C20.1 51.5,42.8 | C19.1 48,42.7 48.1,42.8 | R5.1 34.36,51.6 35.1,51.6 | R5.1 33.32,51.58 33.2,51.7 | R5.1 34.34,52.36 34.2,52.5 | J2.1 33.5,57 | J2.1 32,58.4 32.1,58.5 | J2.1 30.4,57 | J2.1 32,55.6 | VOUT1=3.6V.1 56.8,49 56.9,48.9 | VOUT1=3.6V.1 54.7,51.2 | VOUT1=3.6V.1 52.6,49 | VOUT1=3.6V.1 54.7,46.9 54.6,46.8
  other vias: 30,58.5 49,43 47,43 30,55.5 49,57 59,57 67,57 49,51 52.5,51 57,51 52.5,47 57,47 50.5,43 52.5,43 54,43 56,43 57.5,43 59.5,43 34,58.5 34,55.5
  pour Top: 27,61 37,61 37,51.4 27,51.4
  pour Top: 44.98,61 70,61 70,40.5 44.98,40.5
  pour Route2: 70,40.5 37.5,40.5 37.5,51 27,51 27,61 45,61 44.99,61.01 70,61
  pour Bottom: 27,61 27,51 37.5,51 37.5,40.5 70,40.5 70,61
VOUT2  (via drill 0.35)
  Top 0.3: U$1.VOUT2 U$1.VOUT1 27.5,20.5 27.5,21.6
  Top 0.5: 46,27.5 60.5,27.5 60.42,27.58 C23.1 48,26 | C24.1 51.5,26 | C25.1 55,26 | C26.1 58.5,26 | VOUT2=2.2V.1 52,20.5 | VOUT2=2.2V.1 57,20.5 | VOUT2=2.2V.1 54.7,18.7 54.5,18.5 | VOUT2=2.2V.1 54.7,22.2 55,22.5
  Top 0.55: U$1.VOUT2 27.5,20.5 | 33.7,25.5 J4.1 | J4.1 30.4,25.5 | J4.1 32,24.1 32.2,23.9 | J4.1 32,27.3
  Route2 0.5: VOUT2=2.2V.1 56.4,20.5 | VOUT2=2.2V.1 52.7,20.5 | VOUT2=2.2V.1 54.7,18.3 54.8,18.2 | VOUT2=2.2V.1 54.7,22.5
  Bottom 0.55: J4.1 33.8,25.5 33.9,25.4 | J4.1 30,25.5 | J4.1 32,27.2 | J4.1 32,23.7 31.9,23.6 31,24.5 | R6.1 35.4,19.9 | R6.1 34.24,21.16 34.2,21.2 | R6.1 33.2,19.9 | VOUT2=2.2V.1 57,20.5 57.1,20.6 | VOUT2=2.2V.1 52.8,20.5 | VOUT2=2.2V.1 54.7,22.3 | VOUT2=2.2V.1 54.7,18.8 | 48,25.5 C23.1 | C23.1 47.92,27.5 45.4,27.5 | C23.1 60.48,27.58 60.5,27.6 | C24.1 51.5,26.1 | C25.1 55,26.2 | C26.1 58.5,26
  other vias: 30,27 30,24 34,24 34,27 47,26 49,26 50.5,26 52.5,26 54,26 56,26 57.5,26 59.5,26 49,22.5 52.5,22.5 57,22.5 52.5,18.5 57,18.5 49,15 66,15 58,7 49,7 66,7
  pour Top: 45,29 70,29 70,0 45,0
  pour Top: 37,29 27,29 27,19.5 37,19.5
  pour Route2: 70,29 27,29 27,19.5 45,19.5 45,0 70,0
  pour Bottom: 27,29 27,19.5 45,19.5 45,0 70,0 70,29
VS1  (via drill 0.35)
  Top 0.55: U$2.VS110 19.5,40.7 | U$2.VS110 19.5,51.2 | U$2.VS11 18.9,50.2 | U$2.VS12 18.9,49.2 | U$2.VS13 18.8,48.2 | U$2.VS14 18.8,47.2 | U$2.VS15 18.7,46.2 | U$2.VS16 18.8,45.2 | U$2.VS17 18.9,44.2 | U$2.VS18 18.7,43.2 | U$2.VS19 18.9,42.2 | U$2.VS110 18.9,41.2 | J1.1 18.6,57 18.7,56.9 | J1.1 15.7,57 | J1.1 17,55.6 16.9,55.5 | J1.1 17,59
  Route2 0.5: 18.5,43.5 18.6,43.4 | 17,45.1 17.1,45.2
  other vias: 8,57 8,45 15,58.5 15,55.5 19,58.5 19,55.5
  pour Top: 20,40.4 0,40.4 0,61 20,61
  pour Route2: 0,40.5 20,40.5 20,61 0,61
VS12  (via drill 0.35)
  Top 0.55: U$1.VS110 19.5,8.8 | U$1.VS110 19.5,19.1 19.6,19.2 | U$1.VS11 18.7,18.3 18.6,18.4 | U$1.VS12 18.6,17.3 | U$1.VS13 18.6,16.3 | U$1.VS14 18.8,15.3 | U$1.VS15 18.8,14.3 | U$1.VS16 18.9,13.3 | U$1.VS17 18.8,12.3 | U$1.VS18 18.9,11.3 | U$1.VS19 18.8,10.3 | U$1.VS110 18.9,9.3 | J3.1 18.4,25.5 18.5,25.4 | J3.1 15.3,25.5 | 17,23.5 J3.1 | J3.1 17,27.2 17.1,27.3
  other vias: 8,27 16,21 8,21 8,15 15,27 15,24 19,27 19,24
  pour Top: 20,8.5 0,8.5 0,31.5 20,31.5
  pour Route2: 0,31.5 20,31.5 20,8.7 0,8.7

### Text on the board
tNames: DC to DC converter Ver. 6.1 / Designed by W. Lee and T. Lee | 30 V < VIN < 60 V | L1 | L2 | KOREA UNIV. / Elementary Particle Physics Lab. / Supported by SNU | muon g-2/EDM Experiment at J-PARC